# EAGLE design Shift register shematic (EAGLE 7.6.0)
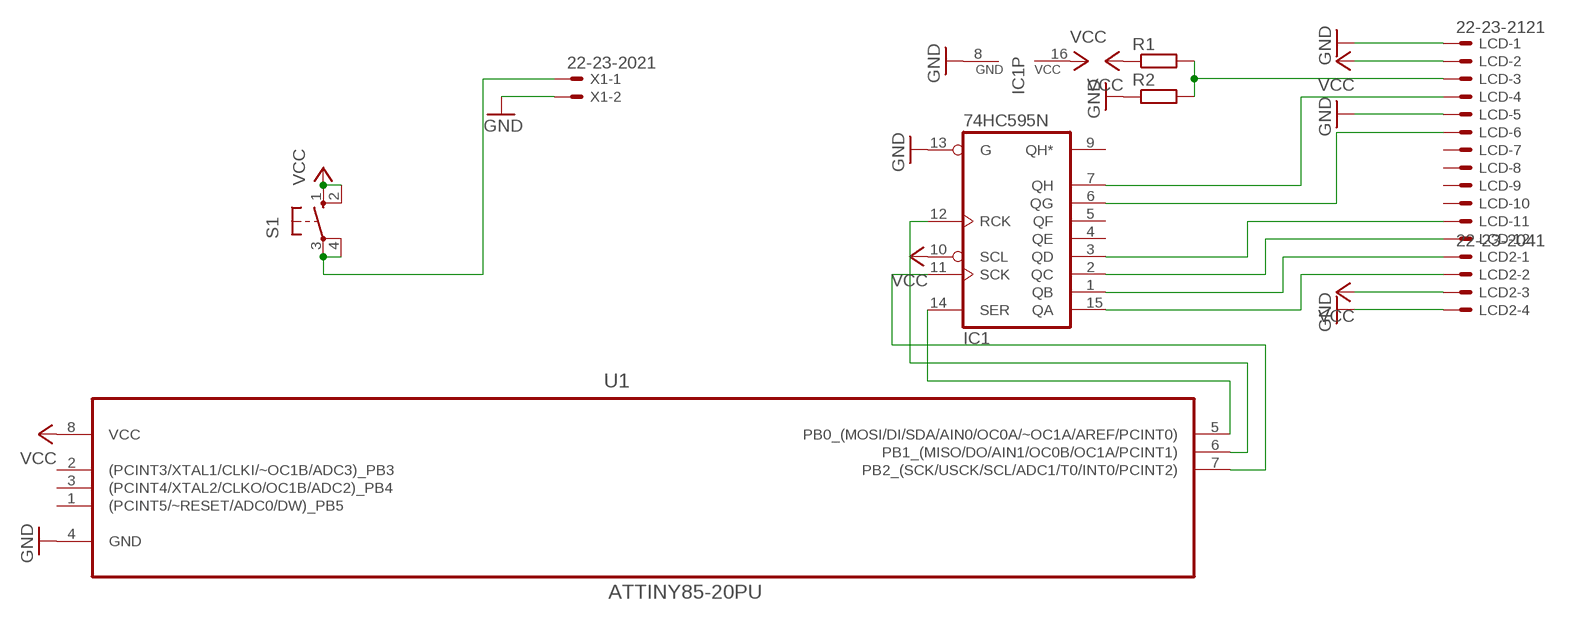
[diagram p0: schematic, sheet 1]

## Parts
IC1  74HC595N  [DIL16]
LCD  22-23-2121  [22-23-2121]
LCD2  22-23-2041  [22-23-2041]
R1  R-EU_0207/10  [0207/10]
R2  R-EU_0207/10  [0207/10]
S1  40-XX  [B3F-40XX]
U1  ATTINY85-20PU  [DIP254P762X533-8]
X1  22-23-2021  [22-23-2021]

## Nets
GND: IC1.8(GND) IC1.13(G) LCD2.4 LCD.1 LCD.5 R2.1 U1.4(GND) X1.2
N$1: IC1.15(QA) LCD2.2
N$2: IC1.1(QB) LCD2.1
N$3: IC1.2(QC) LCD.12
N$4: IC1.3(QD) LCD.11
N$5: IC1.6(QG) LCD.6
N$6: IC1.7(QH) LCD.4
N$7: IC1.14(SER) U1.5(PB0_(MOSI/DI/SDA/AIN0/OC0A/~OC1A/AREF/PCINT0))
N$8: IC1.12(RCK) U1.6(PB1_(MISO/DO/AIN1/OC0B/OC1A/PCINT1))
N$9: IC1.11(SCK) U1.7(PB2_(SCK/USCK/SCL/ADC1/T0/INT0/PCINT2))
N$10: LCD.3 R1.2 R2.2
N$12: S1.3(P) S1.4(P1) X1.1
VCC: IC1.10(SCL) IC1.16(VCC) LCD2.3 LCD.2 R1.1 S1.1(S) S1.2(S1) U1.8(VCC)
Unconnected: IC1.4(QE) IC1.5(QF) IC1.9(QH*) LCD.7 LCD.8 LCD.9 LCD.10 U1.1((PCINT5/~RESET/ADC0/DW)_PB5) U1.2((PCINT3/XTAL1/CLKI/~OC1B/ADC3)_PB3) U1.3((PCINT4/XTAL2/CLKO/OC1B/ADC2)_PB4)

## Library data of the parts
IC1 = 74xx-eu:74*595: 8-bit SHIFT REGISTER, output latch
LCD = con-molex:22-23-2121: .100" (2.54mm) Center Header - 12 Pin; MF: MOLEX; MPN: 22-23-2121; OC_FARNELL: 1462935; OC_NEWARK: 56H0456
LCD2 = con-molex:22-23-2041: .100" (2.54mm) Center Header - 4 Pin; MF: MOLEX; MPN: 22-23-2041; OC_FARNELL: 1462920; OC_NEWARK: 38C0355
R1 R2 = resistor:R-EU_: RESISTOR, European symbol
S1 = switch-omron:40-XX: OMRON SWITCH; MF: OMRON COMPONENTS USA; MPN: B3F-4000; OC_FARNELL: 176434; OC_NEWARK: 36K3105
U1 = Atmel_By_element14_Batch_1-00:ATTINY85-20PU: 8-bit Microcontroller with In-System Programmable Flash; MPN: ATTINY85-20PU; OC_FARNELL: 1455162; OC_NEWARK: 58M3796; PACKAGE: PDIP-8; SUPPLIER: Atmel
X1 = con-molex:22-23-2021: .100" (2.54mm) Center Header - 2 Pin; MF: MOLEX; MPN: 22-23-2021; OC_FARNELL: 1462926; OC_NEWARK: 25C3832

## Net classes
0 default: width 0.203 mm

## Board
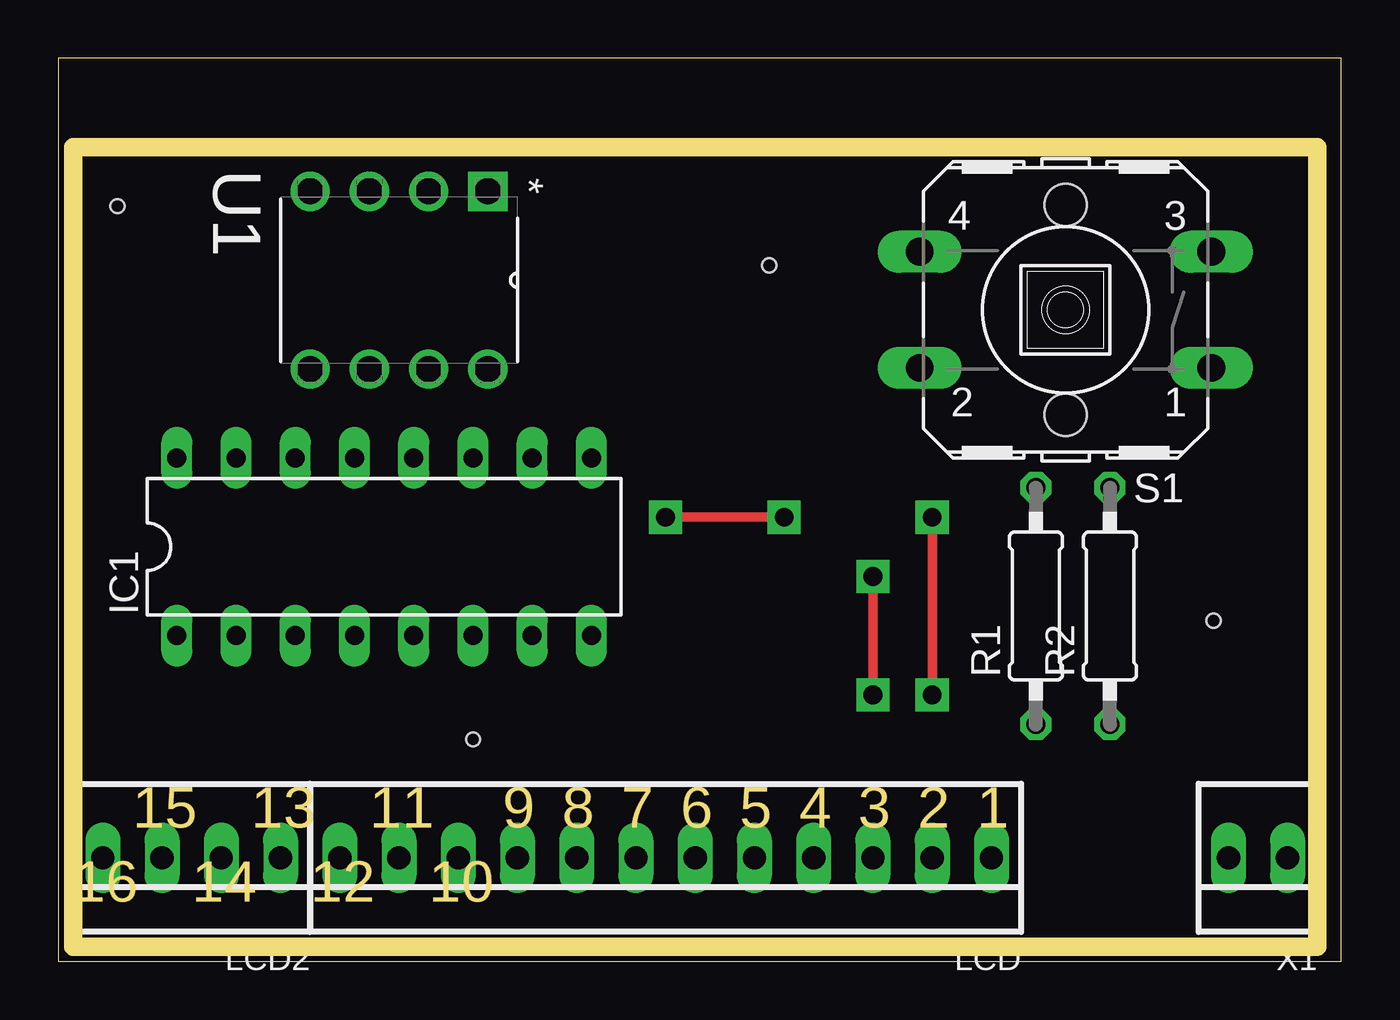
[diagram p1: board, top side]
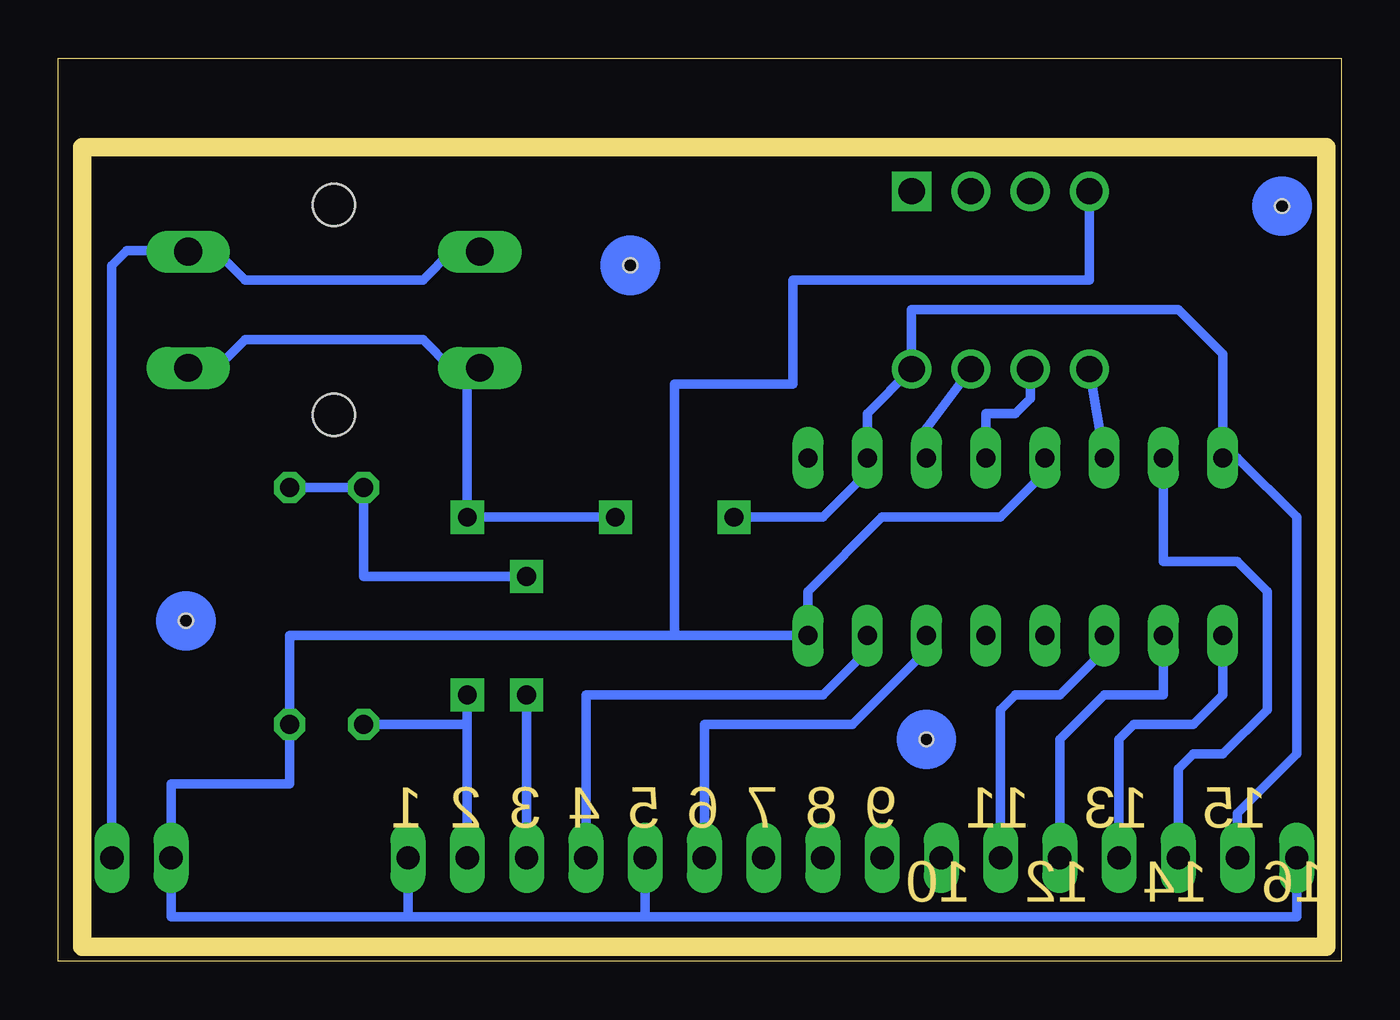
[diagram p2: board, bottom side, seen from below]

Size 55 x 38.73 mm. Coordinates in mm from the lower left corner, seen from the top.
Outline: 0,0 55,0 55,38.73 0,38.73 0,0
Copper layers (1*16): Top 0.035mm / dielectric 1.5mm / Bottom 0.035mm
Design rules "default *": minimum track width 10mil, minimum drill 24mil, track to track 0.79248125mm, track to pad 0.79248125mm, pad to pad 0.79248125mm, via to via 0.79248125mm, smd to smd 0.79248125mm, copper to edge 40mil, drill to drill 8mil, minimum pad ring 10mil, minimum via ring 8mil, stop-mask expansion 4mil, vias tented up to drill 0mil, thermal gap 10mil
Holes 0.6 mm at 2.54,32.38 17.78,9.53 30.48,29.84 49.53,14.61
Milling: 4 lines

### Footprints (pad centres in the part's own frame; a part is rotated, then mirrored left to right if it is on the bottom)
DIL16 = drill 0.813 long: 1 -8.89,-3.81; 2 -6.35,-3.81; 3 -3.81,-3.81; 4 -1.27,-3.81; 5 1.27,-3.81; 6 3.81,-3.81; 7 6.35,-3.81; 8 8.89,-3.81; 9 8.89,3.81; 10 6.35,3.81; 11 3.81,3.81; 12 1.27,3.81; 13 -1.27,3.81; 14 -3.81,3.81; 15 -6.35,3.81; 16 -8.89,3.81
22-23-2121 = drill 1 long: 1 -13.97,0; 2 -11.43,0; 3 -8.89,0; 4 -6.35,0; 5 -3.81,0; 6 -1.27,0; 7 1.27,0; 8 3.81,0; 9 6.35,0; 10 8.89,0; 11 11.43,0; 12 13.97,0
22-23-2041 = drill 1 long: 1 -3.81,0; 2 -1.27,0; 3 1.27,0; 4 3.81,0
0207/10 = drill 0.813 octagon: 1 -5.08,0; 2 5.08,0
B3F-40XX = drill 1.194 long: 1 -6.248,2.489; 2 6.248,2.489; 3 -6.248,-2.489; 4 6.248,-2.489 | hole 1.803: 0,-4.496; 0,4.496
DIP254P762X533-8 = drill 1.118 square: 1 -7.62,7.62 | drill 1.118: 2 -7.62,5.08; 3 -7.62,2.54; 4 -7.62,0; 5 0,0; 6 0,2.54; 7 0,5.08; 8 0,7.62
22-23-2021 = drill 1 long: 1 -1.27,0; 2 1.27,0

### Placement (x,y rotation side)
IC1  13.97,17.78 0 top
LCD  26.04,4.45 180 top
LCD2  5.71,4.45 180 top
R1  41.91,15.24 90 top
R2  45.09,15.24 90 top
S1  43.18,27.94 180 top
U1  10.79,25.4 270 top
X1  51.44,4.45 180 top

### Tracks (layer width: path | path; a pad name or v marks a point on that pad's centre or on a via)
GND
  Bottom 0.406: 28.57,13.97 IC1.8 22.86,15.88 19.68,19.05 14.61,19.05 12.7,20.95 IC1.13 | 28.57,13.97 45.09,13.97 R2.1 45.09,7.62 50.16,7.62 X1.2 50.16,1.91 40.01,1.91 | U1.4 10.79,29.21 23.5,29.21 23.5,24.77 28.57,24.77 28.57,13.97 | LCD.1 40.01,1.91 | LCD.5 29.84,1.91 | 29.84,1.91 40.01,1.91 | LCD2.4 1.91,1.91 29.84,1.91
N$1
  Bottom 0.406: IC1.15 7.62,17.14 4.45,17.14 3.17,15.88 3.17,10.79 5.08,8.89 6.35,8.89 6.99,8.26 LCD2.2
N$2
  Bottom 0.406: IC1.1 5.08,11.43 6.35,10.16 8.89,10.16 9.53,9.53 LCD2.1
N$3
  Bottom 0.406: IC1.2 7.62,11.43 10.16,11.43 12.06,9.53 LCD.12
N$4
  Bottom 0.406: IC1.3 10.16,13.34 12.06,11.43 13.97,11.43 14.61,10.79 LCD.11
N$5
  Bottom 0.406: LCD.6 27.3,10.16 20.95,10.16 17.78,13.34 IC1.6
N$6
  Bottom 0.406: IC1.7 20.32,13.34 22.23,11.43 32.38,11.43 LCD.4
N$7
  Bottom 0.406: U1.5 IC1.14
N$8
  Bottom 0.406: U1.6 13.34,24.13 13.97,23.5 15.24,23.5 IC1.12
N$9
  Bottom 0.406: U1.7 17.78,22.86 IC1.11
N$10  (via drill 0.8 pad 1.42)
  Top 0.406: v34.92,11.43 v34.92,16.51
  Bottom 0.406: R2.2 R1.2 41.91,16.51 v34.92,16.51 | LCD.3 v34.92,11.43
N$12
  Bottom 0.406: S1.4 38.15,30.43 39.37,29.21 46.99,29.21 48.26,30.48 49.38,30.48 S1.3 49.48,30.48 52.07,30.48 52.7,29.84 X1.1
VCC  (via drill 0.8 pad 1.42)
  Top 0.406: v26.04,19.05 v31.11,19.05 | v37.47,11.43 v37.47,19.05
  Bottom 0.406: LCD2.3 4.45,6.35 1.91,8.89 1.91,19.05 4.45,21.59 IC1.16 5.08,26.04 6.99,27.94 18.41,27.94 U1.8 20.32,23.5 IC1.10 20.32,20.95 22.23,19.05 v26.04,19.05 | R1.1 37.47,10.16 | 37.47,10.16 LCD.2 | 37.47,10.16 v37.47,11.43 | v31.11,19.05 v37.47,19.05 37.47,25.35 S1.2 38.15,25.45 39.37,26.67 46.99,26.67 48.26,25.4 49.38,25.4 S1.1 50.01,25.4
(copper drawn outside any net)
  shapes: Bottom circle x4

### Text on the board
Dimension: 15 | 13 | 11 | 9 | 8 | 7 | 6 | 5 | 4 | 3 | 2 | 1 | 16 | 14 | 12 | 10